# EAGLE schematic sc (EAGLE 7.3.0)
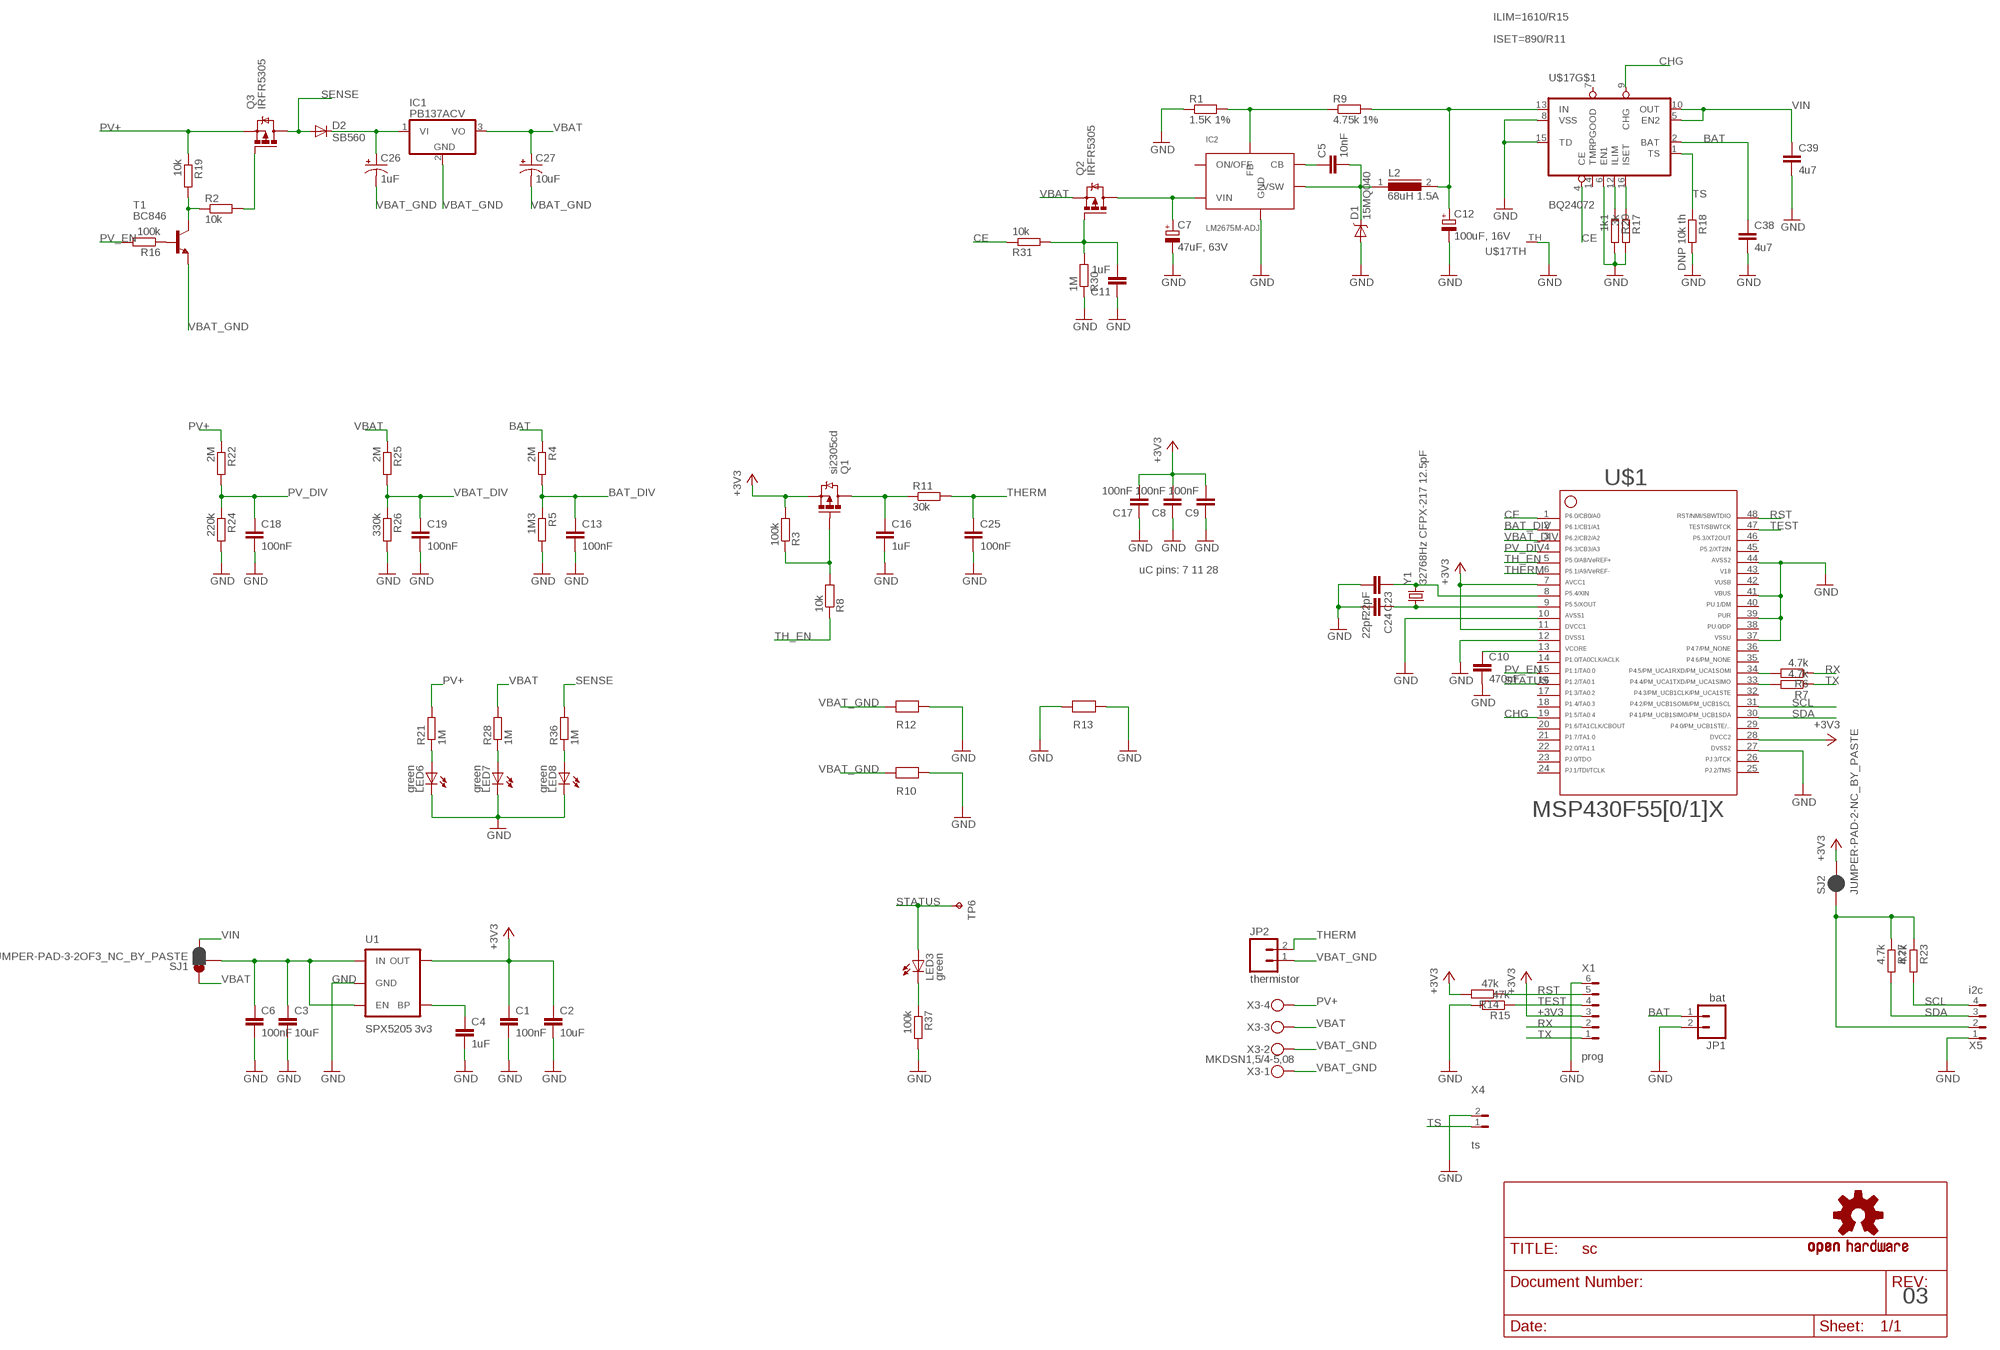
[diagram p0: schematic, sheet 1]

## Parts
C1  100nF  C-EUC0805  [C0805]
C2  10uF  C-EUC1206  [C1206]
C3  10uF  C-EUC1206  [C1206]
C4  1uF  C-EUC0805  [C0805]
C5  10nF  C-EUC0805  [C0805]
C6  100nF  C-EUC0805  [C0805]
C7  47uF, 63V  CPOL-EUF  [PANASONIC_F]
C8  100nF  C-EUC0805  [C0805]
C9  100nF  C-EUC0805  [C0805]
C10  470nF  C-EUC0805  [C0805]
C11  1uF  C-EUC0805  [C0805]
C12  100uF, 16V  CPOL-EUD  [PANASONIC_D]
C13  100nF  C-EUC0805  [C0805]
C16  1uF  C-EUC0805  [C0805]
C17  100nF  C-EUC0805  [C0805]
C18  100nF  C-EUC0805  [C0805]
C19  100nF  C-EUC0805  [C0805]
C23  22pF  C-EUC0805  [C0805]
C24  22pF  C-EUC0805  [C0805]
C25  100nF  C-EUC0805  [C0805]
C26  1uF  CAP_POLD  [PANASONIC_D]
C27  10uF  CAP_POLD  [PANASONIC_D]
C38  4u7  C-EUC1206  [C1206]
C39  4u7  C-EUC1206  [C1206]
D1  15MQ040  DIODE-SCHOTTKY-MBRA140  [SMA-DIODE]
D2  SB560  DIODE-C1702-05  [C1702-05]
IC1  PB137ACV  7812TV  [TO220V]
IC2  LM2675M-ADJ  LM2674  [SO-08]
JP1  bat  M02PTH  [1X02]
JP2  thermistor  M02PTH  [1X02]
L2  68uH 1.5A  DR125  [DR125]
LED3  green  LEDCHIPLED_0805  [CHIPLED_0805]
LED6  green  LEDCHIP-LED0805  [CHIP-LED0805]
LED7  green  LEDCHIP-LED0805  [CHIP-LED0805]
LED8  green  LEDCHIP-LED0805  [CHIP-LED0805]
Q1  si2305cd  MOSFET-PCHANNELSMD_POWER  [SOT23-3_POWER@1]
Q2  IRFR5305  [D-PAK_TO252AA]
Q3  IRFR5305  [D-PAK_TO252AA]
R1  1.5K 1%  R-EU_R0805W  [R0805W]
R2  10k  R-EU_R0805W  [R0805W]
R3  100k  R-EU_R0805W  [R0805W]
R4  2M  R-EU_R0805W  [R0805W]
R5  1M3  R-EU_R0805W  [R0805W]
R6  4.7k  R-EU_R0805W  [R0805W]
R7  4.7k  R-EU_R0805W  [R0805W]
R8  10k  R-EU_R0805W  [R0805W]
R9  4.75k 1%  R-EU_R0805W  [R0805W]
R10  0R_0805  [R0805W]
R11  30k  R-EU_R0805W  [R0805W]
R12  0R_0805  [R0805W]
R13  0R_0805  [R0805W]
R14  47k  R-EU_R0805W  [R0805W]
R15  47k  R-EU_R0805W  [R0805W]
R16  100k  R-EU_R0805W  [R0805W]
R17  3k  R-EU_R0805W  [R0805W]
R18  DNP 10k th  R-EU_R0805W  [R0805W]
R19  10k  R-EU_R0805W  [R0805W]
R20  1k1  R-EU_R0805W  [R0805W]
R21  1M  R-EU_R0805W  [R0805W]
R22  2M  R-EU_R0805W  [R0805W]
R23  4.7k  R-EU_R0805W  [R0805W]
R24  220k  R-EU_R0805W  [R0805W]
R25  2M  R-EU_R0805W  [R0805W]
R26  330k  R-EU_R0805W  [R0805W]
R27  4.7k  R-EU_R0805W  [R0805W]
R28  1M  R-EU_R0805W  [R0805W]
R30  1M  R-EU_R0805W  [R0805W]
R31  10k  R-EU_R0805W  [R0805W]
R36  1M  R-EU_R0805W  [R0805W]
R37  100k  R-EU_R0805W  [R0805W]
SJ1  JUMPER-PAD-3-2OF3_NC_BY_PASTE  [PAD-JUMPER-3-2OF3_NC_BY_PASTE_YES_SILK_FULL_BOX]
SJ2  JUMPER-PAD-2-NC_BY_PASTE  [PAD-JUMPER-2-NC_BY_PASTE_YES_SILK]
T1  BC846  [SOT23]
TP6  TPTP12R  [TP12R]
U1  SPX5205 3v3  V_REG_LDOSMD  [SOT23-5]
U$1  F55[0/1]X---PT48  [PT48]
U$7  OSHW-LOGOM  [OSHW-LOGO-M]
U$17  BQ24072  [S-PVQFN-N16]
X1  prog  MOLEX_6HORIZONTAL  [0530480610]
X3  MKDSN1,5/4-5,08  [MKDSN1,5/4-5,08]
X4  ts  MOLEX_2HORIZONTAL  [0530480210]
X5  i2c  MOLEX_4HORIZONTAL  [0530480401]
Y1  32768Hz CFPX-217 12.5pF  CRYSTAL3.2X1.5  [CRYSTAL-SMD-3.2X1.5]

## Nets
+3V3: C1.1 C2.1 C8.2 C9.2 C17.2 Q1.2(S) R3.2 R14.2 SJ2.2 U1.5(OUT) U$1.7 U$1.11 U$1.28 X1.3
BAT: C38.1 JP1.1 R4.1 U$17.2(BAT)
BAT_DIV: C13.1 R4.2 R5.1 U$1.2
CE: R31.1 U$1.1 U$17.4(CE)
CHG: U$1.19 U$17.9(CHG)
GND: C1.2 C2.2 C3.2 C4.2 C6.2 C7.- C8.1 C9.1 C10.2 C11.1 C12.- C13.2 C16.2 C17.1 C18.2 C19.2 C23.2 C24.2 C25.2 C38.2 C39.2 D1.A IC2.6(GND) JP1.2 LED6.C LED7.C LED8.C R1.1 R5.2 R10.2 R12.2 R13.1 R13.2 R15.2 R17.2 R18.2 R20.2 R24.2 R26.2 R30.1 R37.2 U1.2(GND) U$1.10 U$1.12 U$1.27 U$1.37 U$1.39 U$1.41 U$1.44 U$17.6(EN1) U$17.8(VSS) U$17.15(TD) U$17.TH(TH:TH) X1.6 X4.2 X5.1
N$1: C16.1 Q1.3(D) R11.1
N$2: C4.1 U1.4(BP)
N$3: R16.1 T1.1(B)
N$4: IC2.4(FB) R1.2 R9.1
N$5: R2.1 R19.2 T1.3(C)
N$6: C10.1 U$1.13
N$7: C3.1 C6.1 SJ1.2 U1.1(IN) U1.3(EN)
N$8: C26.+ D2.C IC1.1(VI)
N$9: C5.2 D1.C IC2.8(VSW) L2.1
N$10: C5.1 IC2.1(CB)
N$11: R6.2 U$1.34
N$12: LED6.A R21.1
N$13: R7.2 U$1.33
N$14: Q1.1(G) R3.1 R8.2
N$15: C12.+ L2.2 R9.2 U$17.13(IN)
N$16: C11.2 Q2.1(G) R30.2 R31.2
N$17: R23.1 R27.1 SJ2.1 X5.2
N$18: LED7.A R28.1
N$24: LED8.A R36.1
N$25: C24.1 U$1.9 Y1.P$1
N$26: C23.1 U$1.8 Y1.P$2
N$28: Q3.1(G) R2.2
N$29: R17.1 U$17.16(ISET)
N$33: R20.1 U$17.12(ILIM)
N$38: LED3.C R37.1
N$49: C7.+ IC2.7(VIN) Q2.4(D)
PV+: Q3.3(S) R19.1 R21.2 R22.1 X3.4
PV_DIV: C18.1 R22.2 R24.1 U$1.4
PV_EN: R16.2 U$1.15
RST: R14.1 U$1.48 X1.5
RX: R6.1 X1.2
SCL: R23.2 U$1.31 X5.4
SDA: R27.2 U$1.30 X5.3
SENSE: D2.A Q3.4(D) R36.2
STATUS: LED3.A TP6.TP U$1.16
TEST: R15.1 U$1.47 X1.4
TH_EN: R8.1 U$1.5
THERM: C25.1 JP2.2 R11.2 U$1.6
TS: R18.1 U$17.1(TS) X4.1
TX: R7.1 X1.1
VBAT: C27.+ IC1.3(VO) Q2.3(S) R25.1 R28.2 SJ1.1 X3.3
VBAT_DIV: C19.1 R25.2 R26.1 U$1.3
VBAT_GND: C26.- C27.- IC1.2(GND) JP2.1 R10.1 R12.1 T1.2(E) X3.1 X3.2
VIN: C39.1 SJ1.3 U$17.5(EN2) U$17.10(OUT)
Unconnected: IC2.5(ON/OFF) U$1.14 U$1.17 U$1.18 U$1.20 U$1.21 U$1.22 U$1.23 U$1.24 U$1.25 U$1.26 U$1.29 U$1.32 U$1.35 U$1.36 U$1.38 U$1.40 U$1.45 U$17.7(PGOOD) U$17.14(TMR)

## Notes on the sheet
- ILIM=1610/R15
- ISET=890/R11
- uC pins: 7 11 28
- 03

## Power pins joined to a net without a drawn wire
42: U$1.42
43: U$1.43
46: U$1.46

## Library data of the parts
C1-C6 C8-C11 C13 C16-C19 C23-C25 C38 C39 = rcl:C-EU: CAPACITOR, European symbol
C7 C12 = rcl:CPOL-EU: POLARIZED CAPACITOR, European symbol
C26 C27 = SparkFun-Capacitors:CAP_POL: Capacitor Polarized These are standard SMD and PTH capacitors. Normally 10uF, 47uF, and 100uF in electrolytic and tantalum varieties. Always verify the external diameter of the through hole cap, it varies with capacity, voltage, and manufacturer. The EIA devices should be standard.
D1 = SparkFun-DiscreteSemi:DIODE-SCHOTTKY: Schottky diodes in SFE's production catalog BAT20J 1A 23V 0.62Vf RB751 120mA 40V 0.37Vf PMEG4005EJ 0.5A 40V 0.42Vf MBRA140 1A 40V 0.5Vf B340A 3A 40V SMA; PROD_ID: DIO-08053; VALUE: MBRA140
D2 = diode:DIODE-: DIODE
IC1 = linear:78*: Positive VOLTAGE REGULATOR Source: http://cache.national.com/ds/LM/LM78L05.pdf http://www.fairchildsemi.com/ds/LM/LM7805.pdf
IC2 = Simplex-ICs:LM2674: LM2674 power converter
JP1 JP2 = SparkFun-Connectors:M02: Header 2 Standard 2-pin 0.1" header. Use with straight break away headers (SKU : PRT-00116), right angle break away headers (PRT-00553), swiss pins (PRT-00743), machine pins (PRT-00117), and female headers (PRT-00115). Molex polarized connector foot print use with SKU : PRT-08233 with associated crimp pins and housings.
L2 = inductors:DR125: High Power Density, High Efficiency, Shielded Inductors Source: coiltronics_dr_series.pdf
LED3 LED6-LED8 = led:LED: LED OSRAM: - CHIPLED LG R971, LG N971, LY N971, LG Q971, LY Q971, LO R971, LY R971 LH N974, LH R974 LS Q976, LO Q976, LY Q976 LO Q996 - Hyper CHIPLED LW Q18S LB Q993, LB Q99A, LB R99A - SideLED LS A670, LO A670, LY A670, LG A670, LP A670 LB A673, LV A673, LT A673, LW A673 LH A674 LY A675 LS A676, LA A676, LO A676, LY A676, LW A676 LS A679, LY A679, LG A679 - Hyper Micro SIDELED® LS Y876, LA Y876, LO Y876, LY Y876 LT Y87S - SmartLED LW L88C, LW L88S LB L89C, LB L89S, LG L890 LS L89K, LO L89K, LY L89K LS L896, LA L896, LO L896, LY L896 - TOPLED LS T670, LO T670, LY T670, LG T670, LP T670 LSG T670, LSP T670, LSY T670, LOP T670, LYG T670 LG T671, LOG T671, LSG T671 LB T673, LV T673, LT T673, LW T673 LH T674 LS T676, LA T676, LO T676, LY T676, LB T676, LH T676, LSB T676, LW T676 LB T67C, LV T67C, LT T67C, LS T67K, LO T67K, LY T67K, LW E67C LS E67B, LA E67B, LO E67B, LY E67B, LB E67C, LV E67C, LT E67C LW T67C LS T679, LY T679, LG T679 LS T770, LO T770, LY T770, LG T770, LP T770 LB T773, LV T773, LT T773, LW T773 LH T774 LS E675, LA E675, LY E675, LS T675 LS T776, LA T776, LO T776, LY T776, LB T776 LHGB T686 LT T68C, LB T68C - Hyper Mini TOPLED® LB M676 - Mini TOPLED Santana® LG M470 LS M47K, LO M47K, LY M47K Source: http://www.osram.convergy.de LUXEON: - LUMILED® LXK2-PW12-R00, LXK2-PW12-S00, LXK2-PW14-U00, LXK2-PW14-V00 LXK2-PM12-R00, LXK2-PM12-S00, LXK2-PM14-U00 LXK2-PE12-Q00, LXK2-PE12-R00, LXK2-PE12-S00, LXK2-PE14-T00, LXK2-PE14-U00 LXK2-PB12-K00, LXK2-PB12-L00, LXK2-PB12-M00, LXK2-PB14-N00, LXK2-PB14-P00, LXK2-PB14-Q00 LXK2-PR12-L00, LXK2-PR12-M00, LXK2-PR14-Q00, LXK2-PR14-R00 LXK2-PD12-Q00, LXK2-PD12-R00, LXK2-PD12-S00 LXK2-PH12-R00, LXK2-PH12-S00 LXK2-PL12-P00, LXK2-PL12-Q00, LXK2-PL12-R00 Source: www.luxeon.com KINGBRIGHT: KA-3528ASYC Source: www.kingbright.com
Q1 = Simplex-DiscreteSemi:MOSFET-PCHANNEL: Generic PMOSFET
Q2 Q3 = transistor-power:IRF?5305: HEXFET Power MOSFET Source: http://www.irf.com/product-info/datasheets/data/irfr5305pbf.pdf
R1-R9 R11 R14-R28 R30 R31 R36 R37 = rcl:R-EU_: RESISTOR, European symbol
R10 R12 R13 = Simplex-Jumpers:0R
SJ1 = SparkFun-Passives:JUMPER-PAD-3-2OF3_NC_BY_PASTE
SJ2 = SparkFun-Passives:JUMPER-PAD-2-NC_BY_PASTE
T1 = transistor:BC846: NPN TRANSISTOR
TP6 = testpad:TP: Test pad
U1 = SparkFun:V_REG_LDO: Voltage Regulator LDO Standard 150mA LDO voltage regulator in SOT-23 layout. Micrel part MIC5205. BP (by-pass) pin is used to lower output noise with 470pF cap.
U$1 = TI_MSP430_v16:F55[0/1]X---PT48: ***F55[0/1/2]X*** PT48 Rev. 1.0 06/2010 "http://www.ti.com/lit/gpn/msp430f5509" Only for FF5504, F5508,F5509,F5510
U$7 = SparkFun:OSHW-LOGO: Open Source Hardware Logo This logo indicates the piece of hardware it is found on incorporates a OSHW license and/or adheres to the definition of open source hardware found here: http://freedomdefined.org/OSHW
U$17 = Simplex-ICs:BQ24072: TI BQ24072 - Li battery charger and power path management ic
X1 = Simplex-Connectors:MOLEX_6: Molex 6 pin connectors 1.25mm PicoBlade
X3 = con-phoenix-508:MKDSN1,5/4-5,08: MKDSN 1,5/ 4-5,08 Printklemme Nennstrom: 13,5 A Nennspannung: 250 V Rastermaß: 5,08 mm Polzahl: 4 Anschlussart: Schraubanschluss Montage: Löten Anschlussrichtung Leiter/Platine: 0 ° Artikelnummer: 1729144 Source: http://eshop.phoenixcontact.com .. 1729144.pdf; MPN: SMKDSN1,5/4-5,08; OC_FARNELL: 1792905; OC_NEWARK: 70R0300
X4 = Simplex-Connectors:MOLEX_2: Molex 2 pin connectors 1.25mm PicoBlade
X5 = Simplex-Connectors:MOLEX_4: Molex 4 pin connectors 1.25mm PicoBlade
Y1 = Simplex-FreqCtrl:CRYSTAL: smd crystals

## Net classes
1 vcc: width 0.203 mm